# EAGLE design carte-cool (EAGLE 9.5.2)

## Sheet 1 of 2
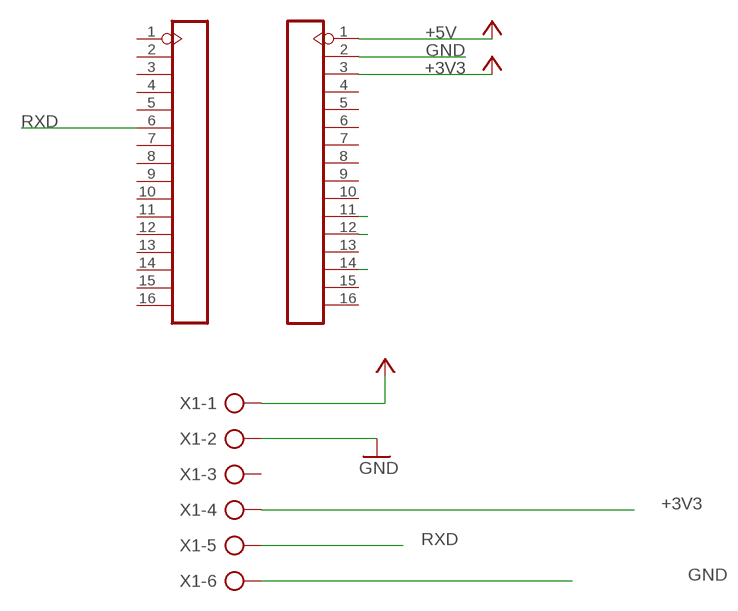
[diagram p0: schematic, sheet 1]

### Parts
J1  16p-2.54  DIP-BLACK-MALE-HEADER-VERT(16P-2.54)  [H16-2.54]
J2  16p-2.54  DIP-BLACK-MALE-HEADER-VERT(16P-2.54)  [H16-2.54]
X1  AK500/6-H  [AK500/6-H]

### Nets
+3V3: J2.3 X1.4
+5V: J2.1 X1.1
GND: J2.2 X1.2 X1.6
P13: J2.14
P15: J2.12
P16: J2.11
RXD: J1.6 X1.5
Unconnected: J1.1 J1.2 J1.3 J1.4 J1.5 J1.7 J1.8 J1.9 J1.10 J1.11 J1.12 J1.13 J1.14 J1.15 J1.16 J2.4 J2.5 J2.6 J2.7 J2.8 J2.9 J2.10 J2.13 J2.15 J2.16 X1.3

## Sheet 2 of 2

## Library data of the parts
J1 J2 = OPL_Connector:DIP-BLACK-MALE-HEADER-VERT(16P-2.54): 320020034; MPN: P125-1116A0BS116AX
X1 = con-ptr500:AK500/6-H: CONNECTOR Aug. 2004 / PTR Meßtechnik: Die Bezeichnung der Serie AK505 wurde geändert. Es handelt sich hierbei um AK500 in horizontaler Ausführung.

## Board
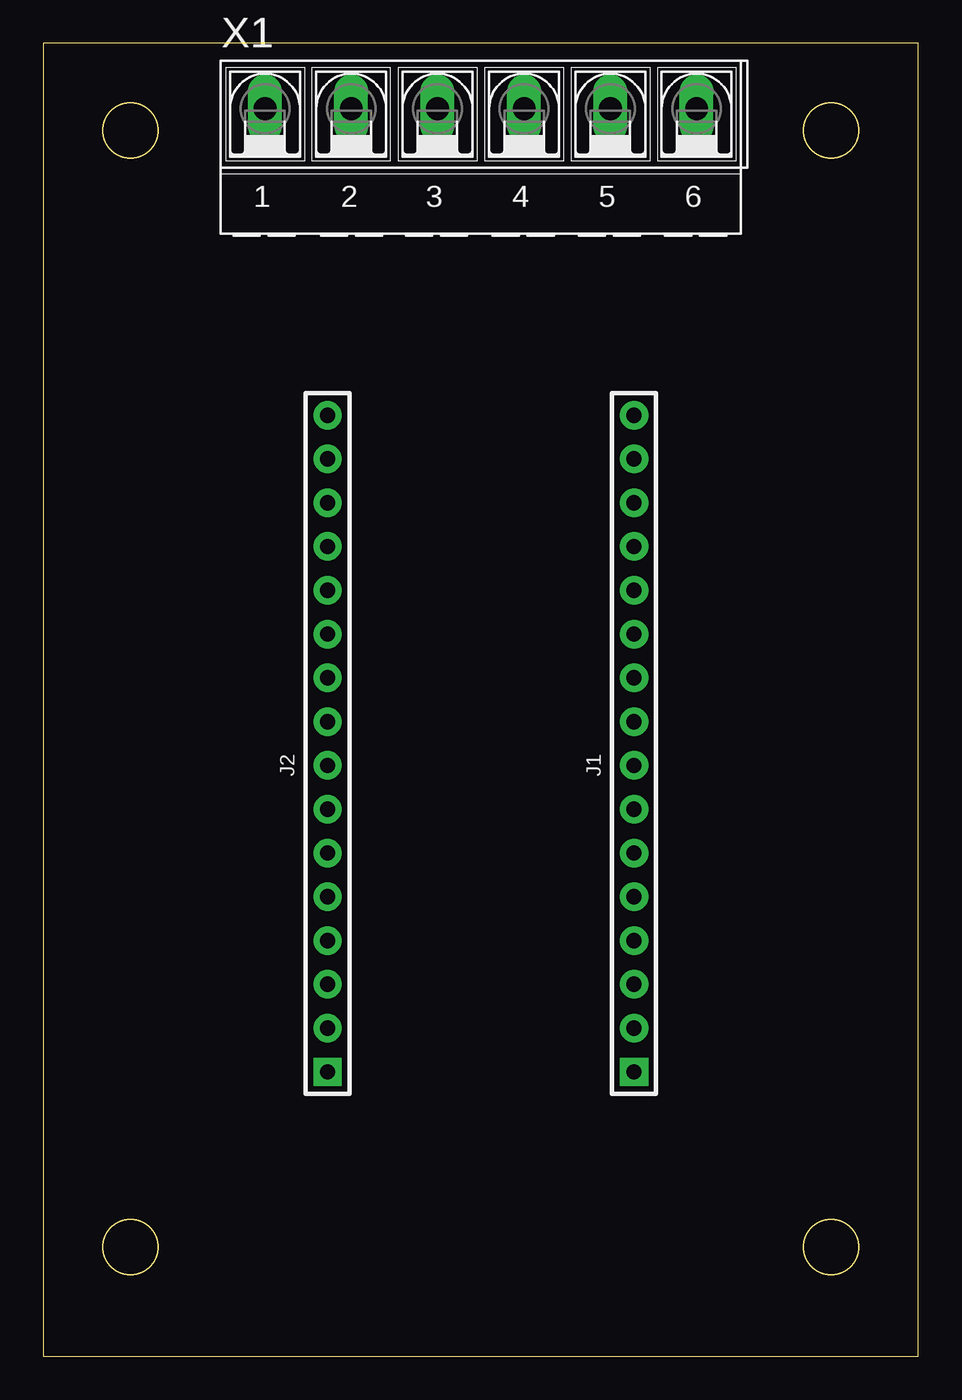
[diagram p1: board, top side]
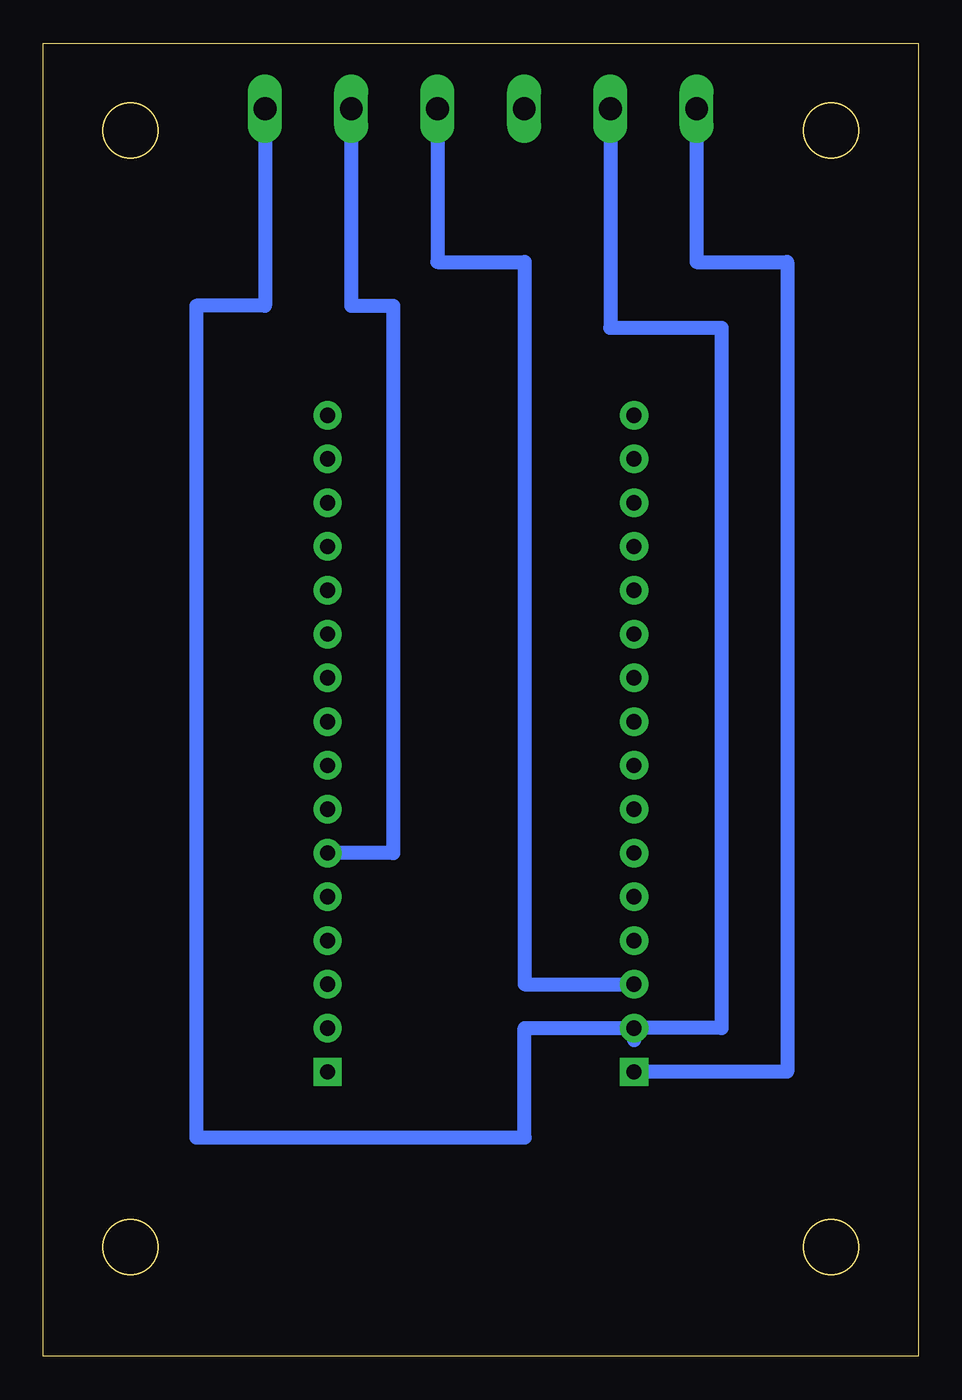
[diagram p2: board, bottom side, seen from below]

Size 50.8 x 76.2 mm. Coordinates in mm from the lower left corner, seen from the top.
Outline: 0,0 50.8,0 50.8,76.2 0,76.2 0,0
Outline: circle at 5.08,71.12 radius 1.6
Outline: circle at 45.72,6.35 radius 1.6
Outline: circle at 45.72,71.12 radius 1.6
Outline: circle at 5.08,6.35 radius 1.6
Copper layers (1*16): Top 0.035mm / dielectric 1.5mm / Bottom 0.035mm
Design rules "default": minimum track width 20mil, minimum drill 0.5mm, track to track 20mil, track to pad 20mil, pad to pad 20mil, via to via 20mil, smd to smd 20mil, copper to edge 30mil, drill to drill 20mil, minimum pad ring 10mil, minimum via ring 8mil, stop-mask expansion 4mil, vias tented up to drill 0mil, thermal gap 10mil

### Footprints (pad centres in the part's own frame; a part is rotated, then mirrored left to right if it is on the bottom)
H16-2.54 = drill 0.889 pad 1.651 square: 1 0,-19.05 | drill 0.889 pad 1.651: 2 0,-16.51; 3 0,-13.97; 4 0,-11.43; 5 0,-8.89; 6 0,-6.35; 7 0,-3.81; 8 0,-1.27; 9 0,1.27; 10 0,3.81; 11 0,6.35; 12 0,8.89; 13 0,11.43; 14 0,13.97; 15 0,16.51; 16 0,19.05
AK500/6-H = drill 1.321 long: 1 -12.522,0; 2 -7.518,0; 3 -2.515,0; 4 2.515,0; 5 7.518,0; 6 12.522,0

### Placement (x,y rotation side)
J1  34.29,35.56 0 top
J2  16.51,35.56 0 top
X1  25.4,72.39 0 top

### Tracks (layer width: path | path; a pad name or v marks a point on that pad's centre or on a via)
+3V3
  Bottom 0.813: X1.4 27.91,63.5 22.86,63.5 22.86,21.59 J2.3
+5V
  Bottom 0.813: X1.1 12.88,63.5 7.62,63.5 7.62,16.51 J2.1
GND
  Bottom 0.813: J2.2 16.51,18.35 | X1.2 17.88,59.69 11.43,59.69 11.43,19.05 J2.2 | X1.6 37.92,60.96 41.91,60.96 41.91,12.7 22.86,12.7 22.86,19.05 J2.2
RXD
  Bottom 0.813: X1.5 32.92,60.96 30.48,60.96 30.48,29.21 J1.6